# Altium schematic sheet HC_OUTPUTS.SchDoc
size A
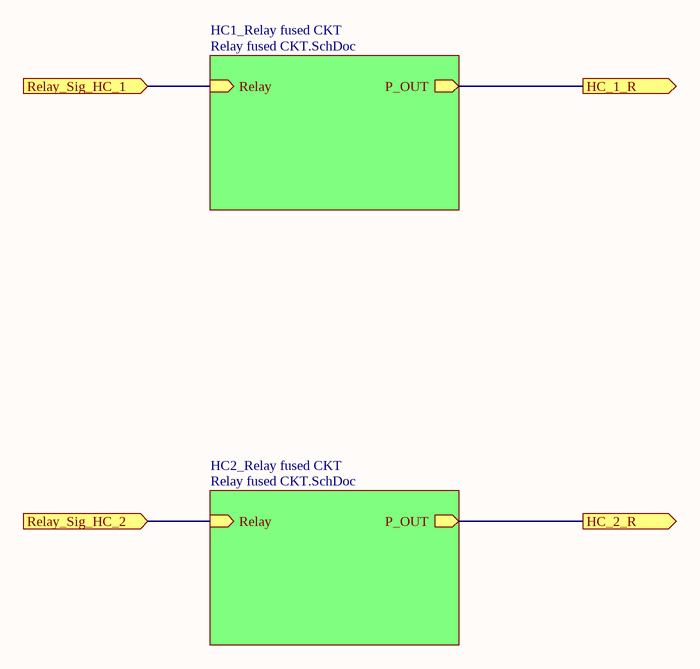
[diagram p0: HC_OUTPUTS.SchDoc]

## Sub-sheets
HC1_Relay fused CKT = Relay fused CKT.SchDoc: P_OUT (out), Relay (in)
HC2_Relay fused CKT = Relay fused CKT.SchDoc: P_OUT (out), Relay (in)

## Ports
HC_1_R (out), HC_2_R (out), Relay_Sig_HC_1 (in), Relay_Sig_HC_2 (in)

## Nets
HC_1_R: port HC_1_R, sheet HC1_Relay fused CKT/P_OUT
HC_2_R: port HC_2_R, sheet HC2_Relay fused CKT/P_OUT
Relay_Sig_HC_1: port Relay_Sig_HC_1, sheet HC1_Relay fused CKT/Relay
Relay_Sig_HC_2: port Relay_Sig_HC_2, sheet HC2_Relay fused CKT/Relay